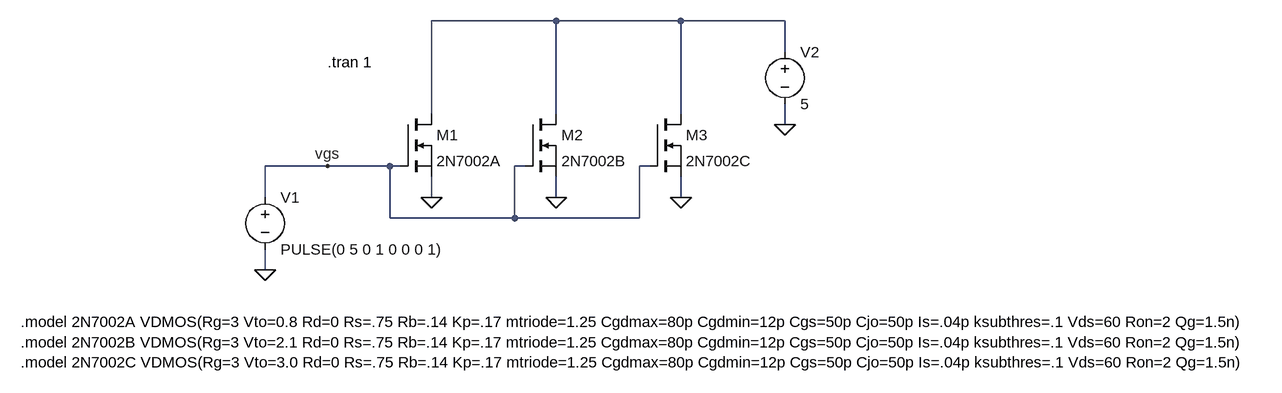
[diagram p0: schematic n-channel-mosfet.asc]
n-channel-mosfet.asc, the LTspice schematic file:
Version 4
SHEET 1 1768 680
WIRE 528 128 336 128
WIRE 720 128 528 128
WIRE 880 128 720 128
WIRE 880 176 880 128
WIRE 336 272 336 128
WIRE 528 272 528 128
WIRE 720 272 720 128
WIRE 880 288 880 256
WIRE 176 352 80 352
WIRE 272 352 176 352
WIRE 288 352 272 352
WIRE 480 352 464 352
WIRE 672 352 656 352
WIRE 80 400 80 352
WIRE 336 400 336 368
WIRE 528 400 528 368
WIRE 720 400 720 368
WIRE 272 432 272 352
WIRE 464 432 464 352
WIRE 464 432 272 432
WIRE 656 432 656 352
WIRE 656 432 464 432
WIRE 80 512 80 480
FLAG 880 288 0
FLAG 80 512 0
FLAG 336 400 0
FLAG 176 352 vgs
FLAG 528 400 0
FLAG 720 400 0
SYMBOL nmos 288 272 R0
SYMATTR InstName M1
SYMATTR Value 2N7002A
SYMBOL voltage 80 384 R0
SYMATTR InstName V1
SYMATTR Value PULSE(0 5 0 1 0 0 0 1)
SYMBOL voltage 880 160 R0
SYMATTR InstName V2
SYMATTR Value 5
SYMBOL nmos 480 272 R0
SYMATTR InstName M2
SYMATTR Value 2N7002B
SYMBOL nmos 672 272 R0
SYMATTR InstName M3
SYMATTR Value 2N7002C
TEXT 176 192 Left 2 !.tran 1
TEXT -296 592 Left 2 !.model 2N7002A VDMOS(Rg=3 Vto=0.8 Rd=0 Rs=.75 Rb=.14 Kp=.17 mtriode=1.25 Cgdmax=80p Cgdmin=12p Cgs=50p Cjo=50p Is=.04p ksubthres=.1 Vds=60 Ron=2 Qg=1.5n)\n.model 2N7002B VDMOS(Rg=3 Vto=2.1 Rd=0 Rs=.75 Rb=.14 Kp=.17 mtriode=1.25 Cgdmax=80p Cgdmin=12p Cgs=50p Cjo=50p Is=.04p ksubthres=.1 Vds=60 Ron=2 Qg=1.5n)\n.model 2N7002C VDMOS(Rg=3 Vto=3.0 Rd=0 Rs=.75 Rb=.14 Kp=.17 mtriode=1.25 Cgdmax=80p Cgdmin=12p Cgs=50p Cjo=50p Is=.04p ksubthres=.1 Vds=60 Ron=2 Qg=1.5n)

The netlist it stands for:
* n-channel-mosfet.asc
M1 N001 vgs 0 0 2N7002A
V1 vgs 0 PULSE(0 5 0 1 0 0 0 1)
V2 N001 0 5
M2 N001 vgs 0 0 2N7002B
M3 N001 vgs 0 0 2N7002C
.model NMOS NMOS
.model PMOS PMOS
.lib standard.mos
.tran 1
.model 2N7002A VDMOS(Rg=3 Vto=0.8 Rd=0 Rs=.75 Rb=.14 Kp=.17 mtriode=1.25 Cgdmax=80p Cgdmin=12p Cgs=50p Cjo=50p Is=.04p ksubthres=.1 Vds=60 Ron=2 Qg=1.5n)
.model 2N7002B VDMOS(Rg=3 Vto=2.1 Rd=0 Rs=.75 Rb=.14 Kp=.17 mtriode=1.25 Cgdmax=80p Cgdmin=12p Cgs=50p Cjo=50p Is=.04p ksubthres=.1 Vds=60 Ron=2 Qg=1.5n)
.model 2N7002C VDMOS(Rg=3 Vto=3.0 Rd=0 Rs=.75 Rb=.14 Kp=.17 mtriode=1.25 Cgdmax=80p Cgdmin=12p Cgs=50p Cjo=50p Is=.04p ksubthres=.1 Vds=60 Ron=2 Qg=1.5n)
.backanno
.end